# EAGLE board rxsms-2.0 (EAGLE 6.6.0)
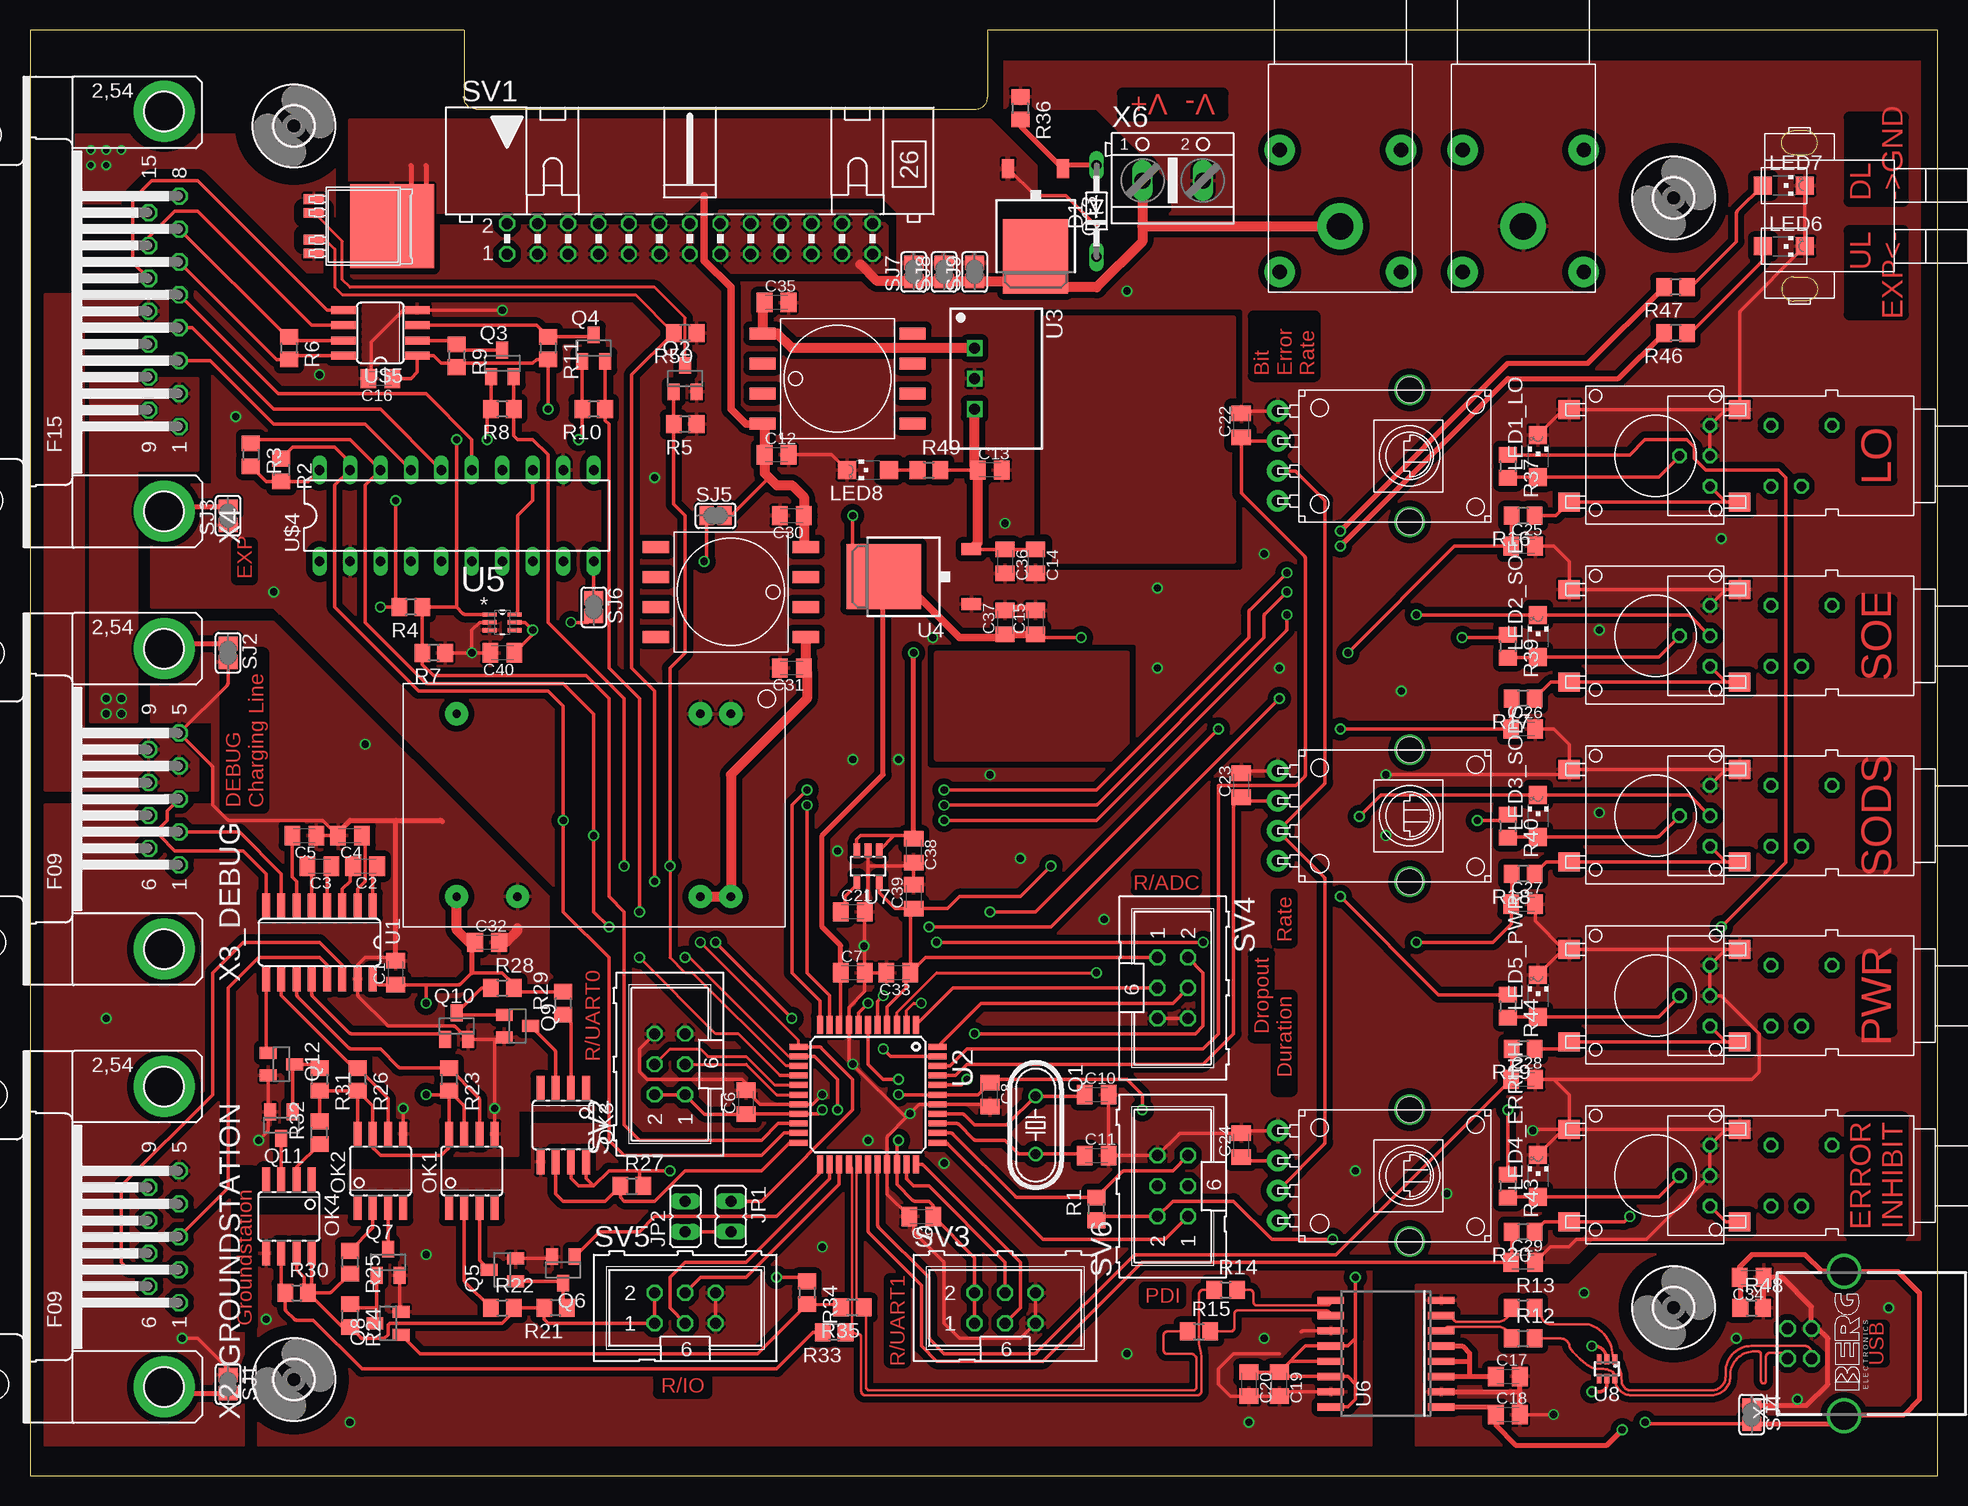
[diagram p8: board, top side]
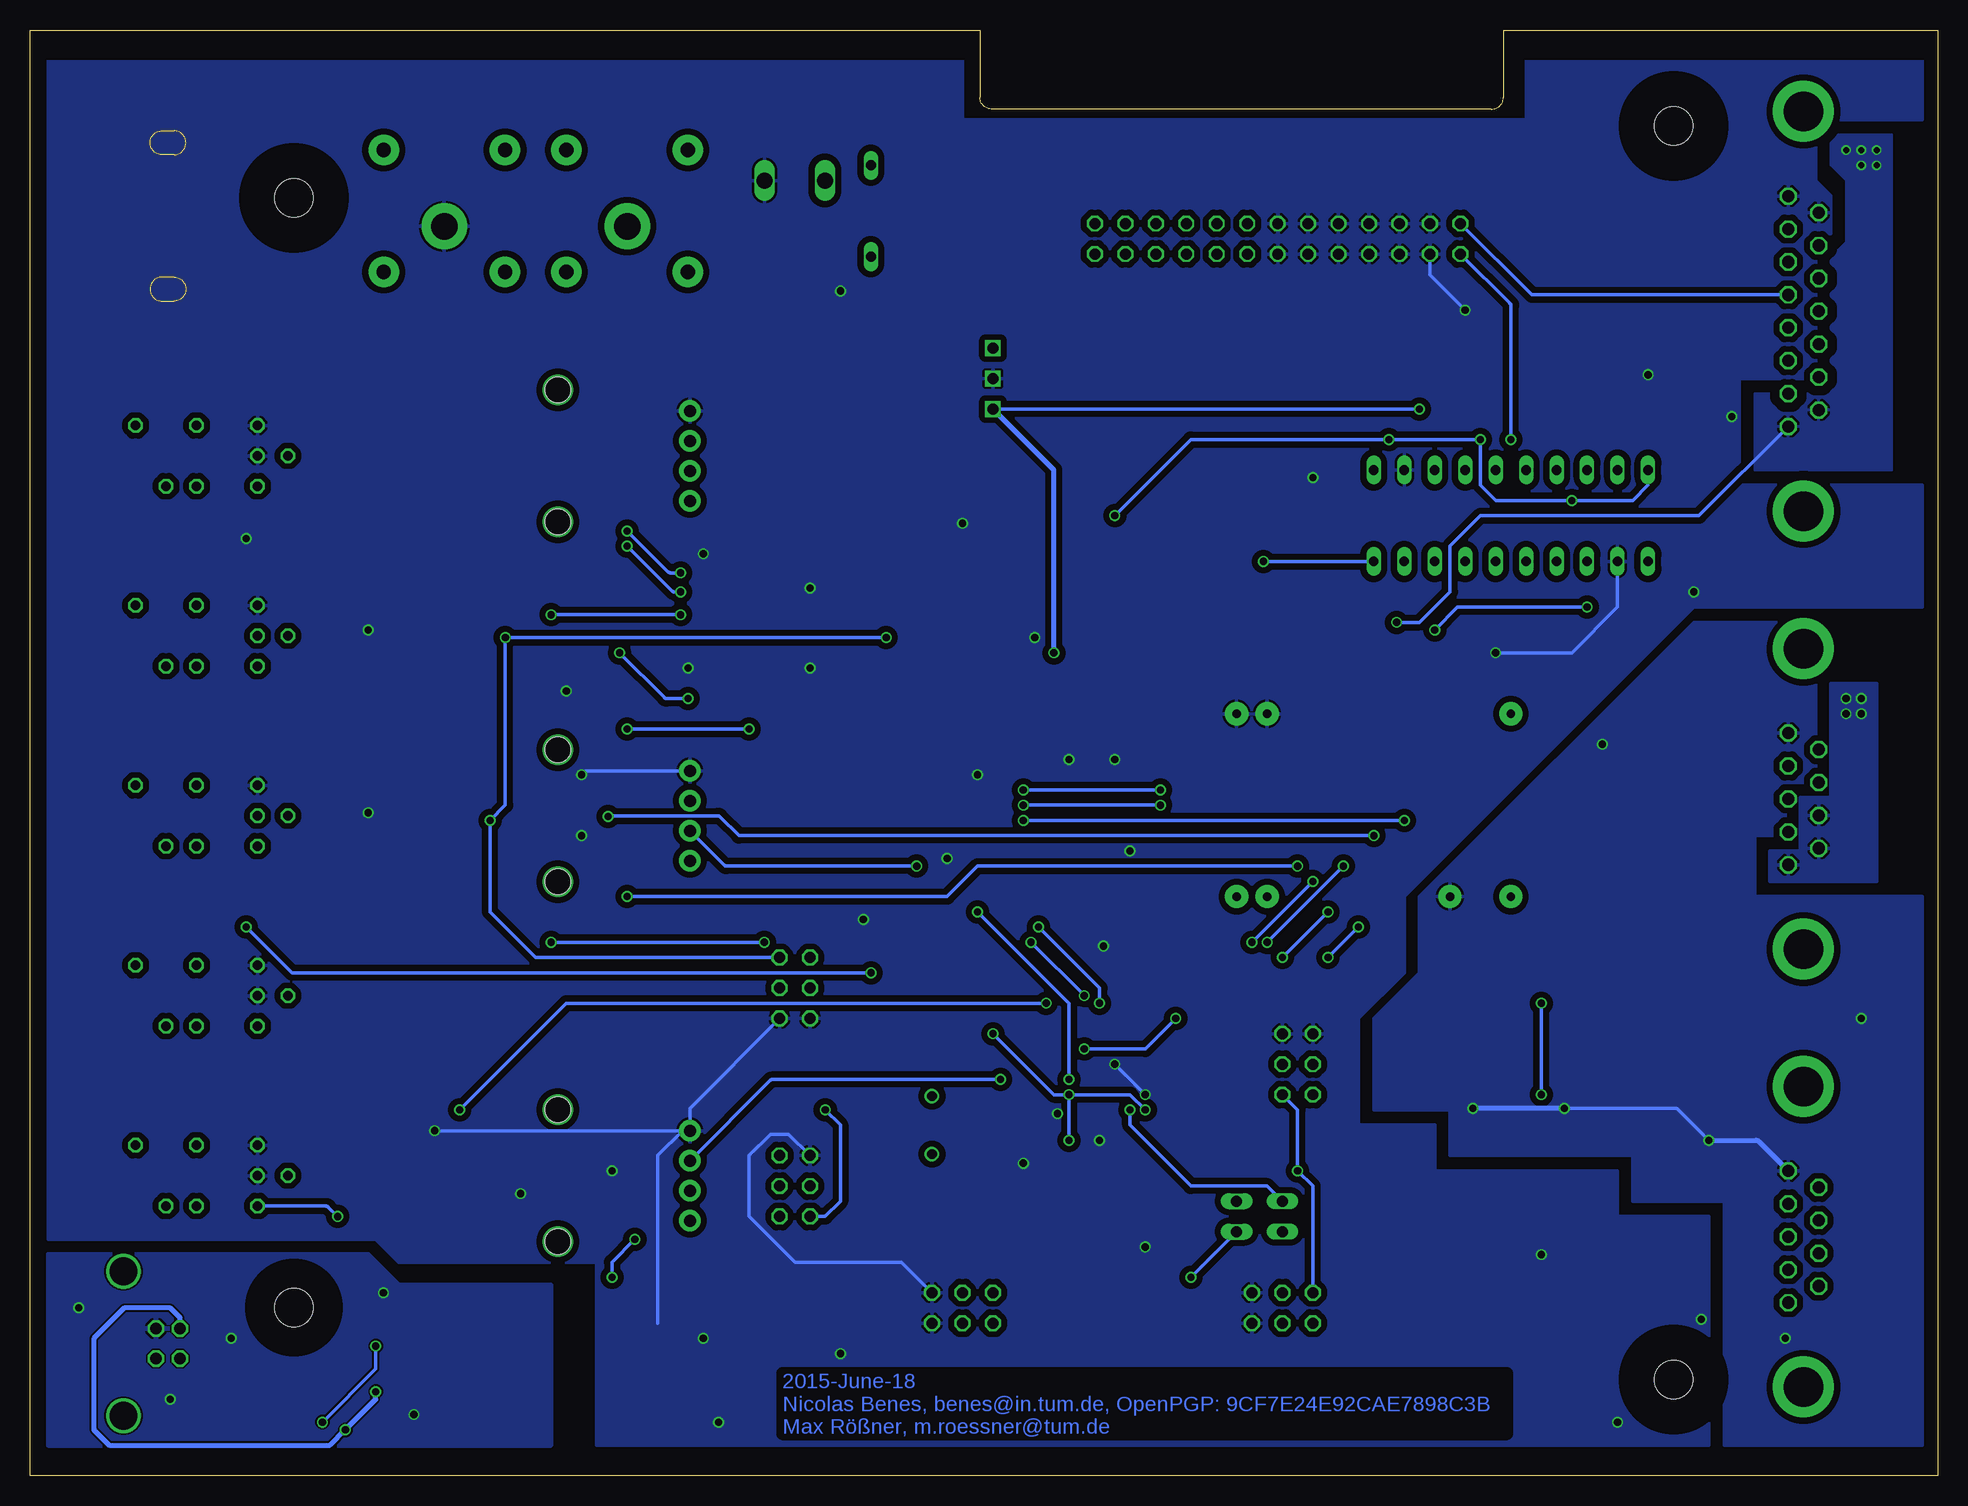
[diagram p9: board, bottom side, seen from below]

Size 159 x 120.5 mm. Coordinates in mm from the lower left corner, seen from the top.
Outline: 0,0 159,0 159,120.5 79.82,120.5 79.82,114.9 arc-90 78.82,113.9 37.18,113.9 arc-90 36.18,114.9 36.18,120.5 0,120.5 0,0
Copper layers (1*16): Top 0.035mm / dielectric 1.5mm / Bottom 0.035mm
Design rules "multi-cb_035um-cu *": minimum track width 6mil, minimum drill 12mil, track to track 6mil, track to pad 6mil, pad to pad 6mil, via to via 6mil, smd to smd 6mil, copper to edge 20mil, drill to drill 8mil, minimum pad ring 8mil, minimum via ring 6mil, stop-mask expansion 3mil, vias tented up to drill 0mil, thermal gap 8mil
tRestrict: area 0,118.5 to 159,120.5; area 0,0 to 159,1.9
bRestrict: area 0,0 to 159,1.9; area 0,118.5 to 159,120.5

## Footprints (pad centres in the part's own frame; a part is rotated, then mirrored left to right if it is on the bottom)
C0805K = smd 1.3 x 1.6: 1 -1,0; 2 1,0
DO34Z7 = drill 0.813 long: A 3.81,0; C -3.81,0
JP1 = drill 0.914 long: 1 0,-1.27; 2 0,1.27
BOURNS-SRR0906 = smd 2.2 x 1: P1 -6.25,3.75; P2 -6.25,1.25; P3 -6.25,-1.25; P4 -6.25,-3.75; P5 6.25,-3.75; P6 6.25,-1.25; P7 6.25,1.25; P8 6.25,3.75
CHIPLED_1206 = smd 1.5 x 1.5: A 0,-1.75; C 0,1.75
SOIC08 = smd 0.66 x 2.032: 1 -1.905,-3.073; 2 -0.635,-3.073; 3 0.635,-3.073; 4 1.905,-3.073; 5 1.905,3.073; 6 0.635,3.073; 7 -0.635,3.073; 8 -1.905,3.073
HC49/S = drill 0.813: 1 -2.413,0; 2 2.413,0
SOT23 = smd 1 x 1.4: 1 -0.95,-1.1; 2 0.95,-1.1; 3 0,1.1
TO252 = smd 1 x 1.6: 1 -2.28,-4.8; 2 2.28,-4.8 | smd 5.4 x 6.2: 3 0,2.5
R0805 = smd 1.3 x 1.5: 1 -0.95,0; 2 0.95,0
SJ = smd 1.168 x 1.6: 1 -0.762,0; 2 0.762,0
ML26L = drill 0.914 octagon: 1 -15.24,-1.27; 2 -15.24,1.27; 3 -12.7,-1.27; 4 -12.7,1.27; 5 -10.16,-1.27; 6 -10.16,1.27; 7 -7.62,-1.27; 8 -7.62,1.27; 9 -5.08,-1.27; 10 -5.08,1.27; 11 -2.54,-1.27; 12 -2.54,1.27; 13 0,-1.27; 14 0,1.27; 15 2.54,-1.27; 16 2.54,1.27; 17 5.08,-1.27; 18 5.08,1.27; 19 7.62,-1.27; 20 7.62,1.27; 21 10.16,-1.27; 22 10.16,1.27; 23 12.7,-1.27; 24 12.7,1.27; 25 15.24,-1.27; 26 15.24,1.27
ML6 = drill 0.914 octagon: 1 -2.54,-1.27; 2 -2.54,1.27; 3 0,-1.27; 4 0,1.27; 5 2.54,-1.27; 6 2.54,1.27
IP67 = smd 1.6 x 1.8: 1 -3.865,7; 2 -3.865,-7.2; 3 3.865,7; 4 3.865,-7.2
SWITCH_LED = drill 0.8 octagon: 1B 5.08,-2.54; 2A 0,-2.54; 2B 2.54,2.54; 3A 10.16,-2.54; 3B 5.08,2.54; A 12.7,0; A1 10.16,2.54; K 10.16,0
SO16 = smd 0.66 x 2.032: 1 -4.445,-3.073; 2 -3.175,-3.073; 3 -1.905,-3.073; 4 -0.635,-3.073; 5 0.635,-3.073; 6 1.905,-3.073; 7 3.175,-3.073; 8 4.445,-3.073; 9 4.445,3.073; 10 3.175,3.073; 11 1.905,3.073; 12 0.635,3.073; 13 -0.635,3.073; 14 -1.905,3.073; 15 -3.175,3.073; 16 -4.445,3.073
TQFP44 = smd 1.5 x 0.5: 1 -5.8,4; 2 -5.8,3.2; 3 -5.8,2.4; 4 -5.8,1.6; 5 -5.8,0.8; 6 -5.8,0; 7 -5.8,-0.8; 8 -5.8,-1.6; 9 -5.8,-2.4; 10 -5.8,-3.2; 11 -5.8,-4; 23 5.8,-4; 24 5.8,-3.2; 25 5.8,-2.4; 26 5.8,-1.6; 27 5.8,-0.8; 28 5.8,0; 29 5.8,0.8; 30 5.8,1.6; 31 5.8,2.4; 32 5.8,3.2; 33 5.8,4 | smd 0.5 x 1.5: 12 -4,-5.8; 13 -3.2,-5.8; 14 -2.4,-5.8; 15 -1.6,-5.8; 16 -0.8,-5.8; 17 0,-5.8; 18 0.8,-5.8; 19 1.6,-5.8; 20 2.4,-5.8; 21 3.2,-5.8; 22 4,-5.8; 34 4,5.8; 35 3.2,5.8; 36 2.4,5.8; 37 1.6,5.8; 38 0.8,5.8; 39 0,5.8; 40 -0.8,5.8; 41 -1.6,5.8; 42 -2.4,5.8; 43 -3.2,5.8; 44 -4,5.8
TSR-1 = drill 0.9 square: 1 -2.54,0; 2 0,0; 3 2.54,0
SOT65P210X110-6N = smd 1.168 x 0.356: 1 -1.041,0.66; 2 -1.041,0; 3 -1.041,-0.66; 4 1.041,-0.66; 5 1.041,0; 6 1.041,0.66
SO-16W = smd 0.6 x 2.2: 1 -4.445,-4.6; 2 -3.175,-4.6; 3 -1.905,-4.6; 4 -0.635,-4.6; 5 0.635,-4.6; 6 1.905,-4.6; 7 3.175,-4.6; 8 4.445,-4.6; 9 4.445,4.6; 10 3.175,4.6; 11 1.905,4.6; 12 0.635,4.6; 13 -0.635,4.6; 14 -1.905,4.6; 15 -3.175,4.6; 16 -4.445,4.6
SOT25 = smd 0.55 x 1.2: 1 -0.95,-1.3; 2 0,-1.3; 3 0.95,-1.3; 4 0.95,1.3; 5 -0.95,1.3
SOT363_PHILIPS = smd 0.4 x 0.8: 1 -0.65,-0.8; 2 0,-0.8; 3 0.65,-0.8; 4 0.65,0.8; 5 0,0.8; 6 -0.65,0.8
3,2 = hole 3.2: 0,0
JACK = drill 1.2 pad 2.54: NC1 -6.36,5.06; NC2 3.8,5.06; NC3 -6.36,-5.06; NC4 3.8,-5.06 | drill 2.2 pad 3.81: P$1 0,0
DIL20 = drill 0.813 long: 1 -3.81,11.43; 2 -3.81,8.89; 3 -3.81,6.35; 4 -3.81,3.81; 5 -3.81,1.27; 6 -3.81,-1.27; 7 -3.81,-3.81; 8 -3.81,-6.35; 9 -3.81,-8.89; 10 -3.81,-11.43; 11 3.81,-11.43; 12 3.81,-8.89; 13 3.81,-6.35; 14 3.81,-3.81; 15 3.81,-1.27; 16 3.81,1.27; 17 3.81,3.81; 18 3.81,6.35; 19 3.81,8.89; 20 3.81,11.43
SO08 = smd 0.66 x 2.032: 1 -1.905,-3.073; 2 -0.635,-3.073; 3 0.635,-3.073; 4 1.905,-3.073; 5 1.905,3.073; 6 0.635,3.073; 7 -0.635,3.073; 8 -1.905,3.073
TO-252-5-1 = smd 0.813 x 1.676: PIN1 -2.255,-3; PIN2 -1.115,-3; PIN4 1.115,-3; PIN5 2.255,-3 | smd 7 x 7: TAB 0,3.51
VERT_POTI = drill 1 pad 1.778: P1 -3.75,-11; P2 -1.25,-11; P3 1.25,-11; P4 3.75,-11 | drill 2.1: P$5 5.5,0; P$6 -5.5,0 | hole 2.1: 5.5,0; -5.5,0
TEN3-2410N = drill 0.7 pad 1.93: P2 0,-15.24; P3 2.54,-15.24; P11 22.86,-15.24; P14 22.86,0; P16 17.78,0; P22 2.54,0; P23 0,0
PN61729-S = drill 0.95 octagon: 1 1.25,4.71; 2 -1.25,4.71; 3 -1.25,2.71; 4 1.25,2.71 | drill 2.3 pad 2.9: S1 -6.02,0; S2 6.02,0
F09HP = drill 1.016 octagon: 1 -5.486,-1.27; 2 -2.743,-1.27; 3 0,-1.27; 4 2.743,-1.27; 5 5.486,-1.27; 6 -4.115,1.27; 7 -1.372,1.27; 8 1.372,1.27; 9 4.115,1.27 | drill 3.302 pad 5.08: G1 -12.522,0; G2 12.522,0
F15HP = drill 1.016 octagon: 1 -9.601,-1.27; 2 -6.858,-1.27; 3 -4.115,-1.27; 4 -1.372,-1.27; 5 1.372,-1.27; 6 4.115,-1.27; 7 6.858,-1.27; 8 9.601,-1.27; 9 -8.23,1.27; 10 -5.486,1.27; 11 -2.743,1.27; 12 0,1.27; 13 2.743,1.27; 14 5.486,1.27; 15 8.23,1.27 | drill 3.302 pad 5.08: G1 -16.662,0; G2 16.662,0
AK500/2 = drill 1.321 long: 1 -2.515,0; 2 2.515,0

## Placement (x,y rotation side)
C1  1u  [C0805K]  30.48,41.91 90 top
C2  1u  [C0805K]  27.94,50.8 180 top
C3  1u  [C0805K]  24.13,50.8 180 top
C4  1u  [C0805K]  26.67,53.34 180 top
C5  1u  [C0805K]  22.86,53.34 180 top
C6  100n  [C0805K]  59.69,31.11 90 top
C7  100n  [C0805K]  68.58,41.91 0 top
C8  100n  [C0805K]  80.01,31.75 270 top
C9  100n  [C0805K]  74.3,21.59 180 top
C10  opt  [C0805K]  88.9,31.75 0 top
C11  opt  [C0805K]  88.9,26.67 0 top
C12  4u7/50V  [C0805K]  62.23,85.09 0 top
C13  4u7/50V  [C0805K]  80.01,83.82 0 top
C14  22u/25V  [C0805K]  83.82,76.2 270 top
C15  22u/25V  [C0805K]  83.82,71.12 90 top
C16  100n  [C0805K]  29.21,91.44 180 top
C17  1u  [C0805K]  123.19,8.26 0 top
C18  1u  [C0805K]  123.19,5.08 0 top
C19  1u  [C0805K]  104.14,7.62 270 top
C20  1u  [C0805K]  101.6,7.62 270 top
C21  100n  [C0805K]  68.58,46.99 0 top
C22  100n  [C0805K]  100.97,87.54 90 top
C23  100n  [C0805K]  100.97,57.54 90 top
C24  100n  [C0805K]  100.97,27.54 90 top
C25  100n  [C0805K]  124.46,77.47 0 top
C26  100n  [C0805K]  124.46,62.23 0 top
C27  100n  [C0805K]  124.46,47.62 0 top
C28  100n  [C0805K]  124.46,33.02 0 top
C29  100n  [C0805K]  124.46,17.78 0 top
C30  4u7/50V  [C0805K]  63.5,80.01 180 top
C31  4u7/50V  [C0805K]  63.5,67.31 180 top
C32  10u/16V  [C0805K]  38.1,44.45 0 top
C33  100n  [C0805K]  72.39,41.91 180 top
C34  4n7  [C0805K]  143.51,16.51 180 top
C35  4u7/50V  [C0805K]  62.23,97.79 0 top
C36  100n  [C0805K]  81.28,76.2 270 top
C37  100n  [C0805K]  81.28,71.12 90 top
C38  100n  [C0805K]  73.66,52.07 270 top
C39  100n  [C0805K]  73.66,48.26 90 top
C40  100n  [C0805K]  39.37,68.58 180 top
D1  12V  [DO34Z7]  88.9,105.41 90 top
JP1  [JP1]  58.42,21.59 180 top
JP2  [JP1]  54.61,21.59 0 top
L1  COIL  [BOURNS-SRR0906]  58.42,73.66 180 top
L2  COIL  [BOURNS-SRR0906]  67.31,91.44 0 top
LED1_LO  YELLOW  [CHIPLED_1206]  125.7,85 0 top
LED2_SOE  YELLOW  [CHIPLED_1206]  125.7,70 0 top
LED3_SODS  YELLOW  [CHIPLED_1206]  125.7,55 0 top
LED4_ERRINH  GREEN  [CHIPLED_1206]  125.7,25 0 top
LED5_PWR  GREEN  [CHIPLED_1206]  125.7,40 0 top
LED6  BERNSTEIN  [CHIPLED_1206]  146.2,102.46 270 top
LED7  BERNSTEIN  [CHIPLED_1206]  146.2,107.54 270 top
LED8  GREEN  [CHIPLED_1206]  69.85,83.82 90 top
OK1  HCPL0600  [SOIC08]  36.83,25.4 0 top
OK2  HCPL0600  [SOIC08]  29.21,25.4 0 top
OK3  HCPL0600  [SOIC08]  44.45,29.21 180 top
OK4  HCPL0600  [SOIC08]  21.59,21.59 180 top
Q1  opt  [HC49/S]  83.82,29.21 270 top
Q2  BSS123  [SOT23]  54.61,91.44 0 top
Q3  BSS123  [SOT23]  39.37,92.71 0 top
Q4  BSS123  [SOT23]  46.99,93.98 0 top
Q5  BSS123  [SOT23]  39.37,17.14 90 top
Q6  BSS123  [SOT23]  44.45,17.14 180 top
Q7  BSS123  [SOT23]  29.84,17.78 0 top
Q8  BSS123  [SOT23]  29.84,12.7 90 top
Q9  BSS123  [SOT23]  40.64,37.47 270 top
Q10  BSS123  [SOT23]  35.56,37.47 0 top
Q11  BSS123  [SOT23]  20.95,29.21 180 top
Q12  BSS123  [SOT23]  20.95,34.29 270 top
Q13  FDD4141TO252  [TO252]  83.82,104.14 180 top
R1  10k  [R0805]  88.9,22.23 90 top
R2  10k  [R0805]  20.95,83.82 270 top
R3  10k  [R0805]  18.41,85.09 270 top
R4  2k2  [R0805]  31.75,72.39 180 top
R5  10k  [R0805]  54.61,87.63 180 top
R6  10k  [R0805]  21.59,93.98 270 top
R7  10k  [R0805]  33.66,68.58 180 top
R8  10k  [R0805]  39.37,88.9 180 top
R9  10k  [R0805]  35.56,93.34 270 top
R10  10k  [R0805]  46.99,88.9 180 top
R11  10k  [R0805]  43.18,93.98 270 top
R12  24/1%  [R0805]  124.46,11.43 0 top
R13  24/1%  [R0805]  124.46,13.97 0 top
R14  24/1%  [R0805]  99.67,15.48 0 top
R15  24/1%  [R0805]  97.43,12 0 top
R16  1k  [R0805]  124.46,80.01 180 top
R17  1k  [R0805]  124.46,64.77 180 top
R18  1k  [R0805]  124.46,50.16 180 top
R19  1k  [R0805]  124.46,35.56 180 top
R20  1k  [R0805]  124.46,20.32 180 top
R21  10k  [R0805]  43.81,13.97 180 top
R22  127  [R0805]  39.37,13.97 0 top
R23  10k  [R0805]  34.93,33.02 270 top
R24  10k  [R0805]  26.67,13.34 270 top
R25  127  [R0805]  26.67,17.78 270 top
R26  10k  [R0805]  27.3,33.02 270 top
R27  10k  [R0805]  50.16,24.13 0 top
R28  10k  [R0805]  39.37,40.64 0 top
R29  270  [R0805]  44.45,39.37 90 top
R30  10k  [R0805]  22.23,15.24 0 top
R31  10k  [R0805]  24.13,33.02 270 top
R32  270  [R0805]  24.13,28.57 90 top
R33  0  [R0805]  67.03,11.95 180 top
R34  0  [R0805]  64.77,15.24 270 top
R35  0  [R0805]  68.55,14.01 180 top
R36  1k  [R0805]  82.55,113.98 270 top
R37  2k2  [R0805]  123.19,84.13 270 top
R39  2k2  [R0805]  123.19,69.13 270 top
R40  2k2  [R0805]  123.19,54.13 270 top
R43  1k  [R0805]  123.19,24.13 270 top
R44  1k  [R0805]  123.19,39.13 270 top
R46  1k/100  [R0805]  137.16,95.25 180 top
R47  1k/100  [R0805]  137.16,99.06 180 top
R48  1M  [R0805]  143.51,13.97 0 top
R49  2k7  [R0805]  74.93,83.82 0 top
R50  330  [R0805]  54.61,95.25 180 top
SCREW1  4-40/M3  [SCREW_DUMMY]  -3.07,7.62 0 top  (outside the outline)
SCREW2  4-40/M3  [SCREW_DUMMY]  -3.19,31.75 0 top  (outside the outline)
SCREW3  4-40/M3  [SCREW_DUMMY]  -3.32,44.45 0 top  (outside the outline)
SCREW4  4-40/M3  [SCREW_DUMMY]  -3.45,68.58 0 top  (outside the outline)
SCREW5  4-40/M3  [SCREW_DUMMY]  -3.57,81.28 0 top  (outside the outline)
SCREW6  4-40/M3  [SCREW_DUMMY]  -3.7,111.76 0 top  (outside the outline)
SJ1  [SJ]  16.51,7.62 270 top
SJ2  [SJ]  16.51,68.58 270 top
SJ3  [SJ]  16.51,80.01 90 top
SJ4  [SJ]  143.51,5.08 270 top
SJ5  [SJ]  57.15,80.01 0 top
SJ6  [SJ]  46.99,72.39 270 top
SJ7  [SJ]  73.66,100.33 90 top
SJ8  [SJ]  76.2,100.33 90 top
SJ9  [SJ]  78.74,100.33 90 top
SV1  [ML26L]  55,103.1 0 top
SV2  [ML6]  53.34,34.29 90 top
SV3  [ML6]  81.28,13.97 0 top
SV4  [ML6]  95.25,40.64 270 top
SV5  [ML6]  54.61,13.97 0 top
SV6  [ML6]  95.25,24.13 90 top
T1_LO  SMS_IP67  [IP67]  135.5,85 270 top
T2_SOE  SMS_IP67  [IP67]  135.5,70 270 top
T3_SOE  SWITCH_LED  [SWITCH_LED]  150.2,70 180 top
T4_PWR  SMS_IP67  [IP67]  135.5,40 270 top
T5_ERRINH  SMS_IP67  [IP67]  135.5,25 270 top
T6_PWR  SWITCH_LED  [SWITCH_LED]  150.2,40 180 top
T7_ERRINH  SWITCH_LED  [SWITCH_LED]  150.2,25 180 top
T8_LO  SWITCH_LED  [SWITCH_LED]  150.2,85 180 top
T9_SODS  SMS_IP67  [IP67]  135.5,55 270 top
T10_SODS  SWITCH_LED  [SWITCH_LED]  150.2,55 180 top
U1  MAX3232ESE  [SO16]  24.13,44.45 180 top
U2  XMEGA-A4UTQFP  [TQFP44]  69.85,31.75 270 top
U3  TSR_1-2450  [TSR-1]  78.74,91.44 270 top
U4  LM1117  [TO252]  73.66,74.93 90 top
U5  NC7WZ17P6X  [SOT65P210X110-6N]  39.37,71.12 0 top
U6  ADUM3160  [SO-16W]  113.03,10.16 90 top
U7  TPS73125  [SOT25]  69.85,50.8 180 top
U8  NUP2202W1  [SOT363_PHILIPS]  131.44,8.89 180 top
U$1  [3,2]  22,8 0 top
U$2  [3,2]  22,112.5 0 top
U$3  black  [JACK]  124.46,104.14 270 top
U$4  UDN2596  [DIL20]  35.56,80.01 90 top
U$5  SP490  [SO08]  29.21,95.25 90 top
U$6  BTS6143  [TO-252-5-1]  26.67,104.14 270 top
U$7  [3,2]  137,14 0 top
U$7_BER  50k  [VERT_POTI]  115,85 270 top
U$8  [3,2]  137,106.5 0 top
U$8_DROPR  50k  [VERT_POTI]  115,55 270 top
U$9  red  [JACK]  109.22,104.14 270 top
U$9_DROPDUR  50k  [VERT_POTI]  115,25 270 top
U$10  TEN3-2410N  [TEN3-2410N]  58.42,48.26 180 top
X1  PN61729-S  [PN61729-S]  151.21,11 90 top
X2_GROUNDSTATION  [F09HP]  11.17,19.9 90 top
X3_DEBUG  [F09HP]  11.17,56.4 90 top
X4  [F15HP]  11.17,97.05 90 top
X5  RLP2-200-500  [RLP2-200-500]  146.2,105 90 top
X6  [AK500/2]  95.25,107.95 0 top

## Tracks (layer width: path | path; a pad name or v marks a point on that pad's centre or on a via)
!EXP_LO
  Top 0.305: X4.5 20.69,90.17 33.02,90.17 36.83,86.36 U$4.15
  Bottom 0.305: SV1.2 33.81,98.42 X4.5
!EXP_SODS
  Top 0.305: X4.3 15.02,92.94 20.32,87.63 27.94,87.63 U$4.17
!EXP_SOE
  Top 0.305: U$4.16 29.21,88.9 20.32,88.9 13.54,95.68 X4.4
!SIM_LO  (via drill 0.6)
  Top 0.305: 35.56,72.39 36.08,71.87 arc45 36.3,71.78 U5.1 | R4.1 35.56,72.39 | R4.1 32.65,72.34 arc45 32.55,72.11 | U2.20 62.37,29.35 60.96,27.94 50.8,27.94 49.53,29.21 49.53,46.99 48.26,48.26 48.26,64.77 46.35,66.67 33.66,66.67 32.7,67.62 R7.2 R4.1 | 35.56,72.39 v35.56,86.36
  Bottom 0.305: SV1.1 35.65,97.72 | 35.65,97.72 arc45 35.56,97.5 | v35.56,86.36 35.56,97.63 35.65,97.72
!SIM_SODS  (via drill 0.6)
  Top 0.254: v50.8,43.18 57.15,36.83 59.05,36.83 62.53,33.35
  Top 0.305: R3.1 18.73,86.36 26.67,86.36 U$4.18 27.94,82.55 27.94,71.12 33.02,66.04 44.45,66.04 46.99,63.5 v46.99,53.34 46.99,46.99 v48.26,45.72 | T10_SODS.K 138.38,56.66 arc45 138.16,56.75 LED3_SODS.C 112.73,56.75 arc45 112.56,56.68 v110.81,54.93 | U2.15 62.53,33.35
  Bottom 0.305: v50.8,43.18 v48.26,45.72 | v46.99,53.34 99.91,53.34 101.48,54.92 arc-45 101.66,54.99 110.65,54.99 arc-45 v110.81,54.93
!SIM_SOE  (via drill 0.6)
  Top 0.305: R2.1 21.91,85.72 25.4,85.72 26.67,84.45 U$4.19 25.4,82.55 25.4,72.39 32.38,65.41 43.18,65.41 44.45,64.14 v44.45,54.61 44.45,46.99 48.26,43.18 48.26,27.94 49.53,26.67 60.96,26.67 62.84,28.55 U2.21 | T3_SOE.K 138.38,71.66 arc45 138.16,71.75 LED2_SOE.C v115.58,71.75 v115.57,71.75 | v76.2,54.61 88.9,54.61 104.7,70.41 arc45 104.78,70.59 v104.78,71.75
  Bottom 0.305: v115.57,71.75 v104.78,71.75 | v76.2,54.61 v44.45,54.61
+3V3  (via drill 0.6)
  Top 0.305: R30.2 23.5,15.56 OK4.8 | OK4.7 22.23,17.14 22.86,16.51 22.86,15.55 R30.2 | U2.9 67.58,37.68 C7.1 | Q3.1 R8.2 38.19,88.67 arc45 38.1,88.45 v38.1,86.36 | Q4.1 R10.2 46.04,86.81 arc-45 45.95,86.59 v45.72,86.36 | C19.1 106.31,10.79 U6.12 109.86,10.79 110.49,11.43 | U6.13 105.05,9.53 C19.1 | C19.1 104.5,8.26 U6.14 109.86,8.26 110.49,7.62 | 110.49,7.62 110.49,6.35 109.86,5.71 U6.16 | C20.1 C19.1 | 123.27,55 R40.1 122.72,54.61 v120.65,54.61 | R39.1 123.27,70 123.12,69.85 v119.38,69.85 | R3.2 19.68,82.87 R2.2 23.18,82.87 U$4.20 | R1.1 89.12,21.5 arc-45 89.35,21.59 SV6.2 95.25,22.86 100.33,22.86 103.5,19.68 v108.58,19.68 | SV3.1 SV3.2 78.74,18.01 arc45 78.65,18.24 C9.1 75.3,22.36 arc45 75.2,22.59 74.93,22.86 73.79,22.86 arc-45 73.57,22.95 72.25,24.27 U2.31 72.25,27.8 v72.39,27.94 | SV2.2 SV2.1 56.24,30.11 C6.1 59.73,30.15 U2.19 65.71,30.15 v66.04,30.48 | U4.3 68.58,77.51 v68.58,80.01 | v30.48,81.28 30.48,72.84 arc45 30.57,72.62 R4.2 v29.21,72.39 | SV5.2 SV5.1 43.18,12.7 42.87,13.02 R21.2 R22.2 40.32,13.65 39.37,12.7 30.1,12.7 arc90 29.84,12.45 29.84,11.75 29.53,11.43 27.73,11.43 arc-45 27.55,11.5 R24.2 26.14,12.38 arc-45 25.96,12.46 R30.2 | v110.49,16.51 110.49,11.43 | 110.49,7.62 110.49,11.43 | v92.71,30.48 92.71,31.75 91.44,33.02 80.28,33.02 C8.1 79.01,31.75 U2.39 v72.39,31.75 | OK3.7 45.09,24.77 45.72,24.13 46.99,24.13 | 46.99,24.13 48.26,25.4 50.8,25.4 | 50.8,25.4 50.8,24.45 R27.2 | 50.8,25.4 v53.34,25.4 | OK3.8 46.35,24.77 46.99,24.13 | v87.63,69.85 84.09,69.85 C15.1 | SV4.2 97.79,41.91 97.79,37.47 97.16,36.83 v78.74,36.83 | C40.1 41.91,70.12 v41.91,70.48 41.27,71.12 U5.5
  Top 0.305: R25.2 25.15,15.31 arc-45 24.98,15.24 R30.2
  Top 0.406: C7.1 67.58,44.18 66.04,45.72 66.04,53.34 71.12,58.42 71.12,74.93 72.39,74.93
  Top 0.61: C15.1 C37.1 81.01,69.85 77.47,69.85 72.39,74.93 U4.3
  Bottom 0.305: v68.58,80.01 62.23,86.36 v45.72,86.36 v38.1,86.36 38.1,82.55 36.83,81.28 v30.48,81.28 25.4,81.28 24.13,82.55 U$4.20 | v108.58,19.68 110.49,17.78 v110.49,16.51 | v92.71,30.48 91.44,29.21 91.44,22.86 92.71,21.59 SV6.2 | v72.39,31.75 v72.39,27.94 | SV2.1 53.34,30.48 v53.34,25.4 52.07,24.13 SV5.2 | v87.63,69.85 v119.38,69.85 119.38,55.88 v120.65,54.61 120.65,46.99 116.84,43.18 SV4.2 | v78.74,36.83 73.66,31.75 v72.39,31.75 | v66.04,30.48 67.31,31.75 v72.39,31.75 | v29.21,72.39 40.01,72.39 v41.91,70.48
+5V  (via drill 0.6)
  Top 0.305: C16.1 31.75,91.44 32.28,91.97 U$5.1 33.66,93.34 34.29,92.71 35.24,92.71 R9.2 35.88,92.71 41.91,92.71 42.23,93.03 R11.2 v43.18,88.9 | C38.1 73.39,53.34 72.04,53.34 | 72.04,53.34 U7.1 | U7.3 68.9,53.02 69.22,53.34 72.04,53.34 | R49.2 C13.1 | C14.1 C36.1 U4.2
  Top 0.406: 73.39,53.34 73.66,53.61 v73.66,68.58
  Top 0.813: U3.3 78.74,84.09 C13.1 79.01,77.76 U4.2
  Bottom 0.305: v43.18,88.9 U3.3
  Bottom 0.406: v73.66,68.58 73.66,83.82 U3.3
+28V_EXP  (via drill 0.5, 0.6)
  Top 0.305: SJ6.2 46.48,71.12 v45.09,71.12
  Bottom 0.305: X4.1 19.88,80.01 38.1,80.01 40.64,77.47 40.64,73.66 43.18,71.12 v45.09,71.12
  other vias: 5.08,110.49 6.35,110.49 6.35,109.22 5.08,109.22 7.62,110.49
  pour Top (isolate 0.813): 22.86,111.76 3.81,111.76 3.81,106.05 15.24,106.05 15.24,104.14 19.05,100.33 25.4,100.33 25.4,109.22
  pour Bottom (isolate 0.813): 8.89,111.76 8.89,109.22 7.62,107.95 7.62,102.87 8.89,101.6 8.89,90.17 15.24,90.17 15.24,83.82 3.81,83.82 3.81,111.76
+28V_SUPPLY
  Top 0.305: SJ5.2 58.42,80.01 61.59,83.19 | Q13.2 83.8,106.68 86.36,106.68 88.9,104.14 D1.C
  Top 0.406: 31.75,109.22 31.75,106.68 | 33.02,109.22 33.02,106.68
  Top 0.61: Q13.2 81.26,109.22 | 56.2,106.68 56.2,101.28 58.42,99.06 58.42,88.9 59.69,87.63 61,87.63 L2.P4 61.23,87.52
  Top 0.813: C30.1 64.5,77.71 arc45 64.59,77.49 L1.P4 | C30.1 64.77,80.01 | 61.23,87.52 C12.1 61.23,83.55 61.59,83.19 62.23,82.55 63.5,82.55 64.5,81.55 C30.1
  pour Top (isolate 0.305): 83.82,106.68 83.82,109.09 80.01,112.9 26.67,112.9 26.67,105.41 54.61,105.41 55.88,106.68 71.12,106.68 72.39,105.41 72.39,100.33 80.33,100.33 80.33,106.68
ADC_CURRENT_SENSE  (via drill 0.6)
  Top 0.254: 24.61,103.03 25.4,102.23 25.4,99.06 26.04,98.42 50.48,98.42 R50.2
  Top 0.305: U$6.PIN4 24.61,103.03 | R50.2 50.16,91.75 50.16,67.31 52.07,65.41 v52.07,49.53 | v57.15,44.45 v63.5,38.1 | v71.12,35.56 71.73,34.95 U2.43
  Bottom 0.305: v52.07,49.53 v57.15,44.45 | v63.5,38.1 66.04,35.56 v71.12,35.56
ADC_POTI_BIT_ERROR_RATE
  Top 0.305: U$7_BER.P2 101.39,86.25 arc-45 101.16,86.34 C22.1 100.97,82.05 arc45 101.06,81.82 106.21,76.67 arc-45 106.3,76.45 106.3,58.42 arc-45 106.21,58.2 105.54,57.53 99.06,57.53 99.06,36.83 97.79,35.56 78.11,35.56 76.69,34.15 U2.42
ADC_POTI_DROP_DURATION  (via drill 0.6)
  Top 0.305: U$9_DROPDUR.P2 101.39,26.25 arc-45 101.16,26.34 C24.1 | U2.40 77.5,32.55 arc45 77.73,32.64 v78.11,33.02
  Bottom 0.305: v78.11,33.02 97.1,33.02 arc-45 97.32,32.93 U$9_DROPDUR.P2
ADC_POTI_DROP_RATE
  Top 0.305: U$8_DROPR.P2 101.39,56.25 arc-45 101.16,56.34 C23.1 100.42,56 arc45 100.33,55.77 100.33,36.83 97.79,34.29 78.11,34.29 77.17,33.35 U2.41
ADC_REF  (via drill 0.6)
  Top 0.305: C39.1 72.12,47.26 70.8,48.58 U7.5 | C33.1 73.03,41.55 73.03,40.64 71.45,39.06 U2.4 | U$7_BER.P3 105.35,83.75 arc-45 105.57,83.66 107.95,81.28 107.95,57.83 arc-45 107.86,57.61 U$8_DROPR.P3 107.86,49.89 arc-45 107.95,49.67 107.95,27.83 arc-45 107.86,27.61 U$9_DROPDUR.P3 | C33.1 73.39,46.99 C39.1 | SV4.1 74.66,43.18 C33.1 | v85.09,50.8 82.55,48.26 77.47,48.26 76.47,47.26 C39.1
  Bottom 0.305: 103.59,53.34 U$8_DROPR.P3 101.12,50.87 arc-45 100.94,50.8 v85.09,50.8
DEBUG_RX_D-
  Top 0.191: U2.26 68.41,25.79 arc-45 68.5,25.57 68.5,12.61 arc-45 68.41,12.38 | 68.41,12.38 R33.1 | 68.41,12.38 arc90 68.98,11.81 arc-90 69.29,11.5 69.29,7.01 arc90 69.61,6.69 97.32,6.69 arc90 97.64,7.01 97.64,9.55 arc16 97.45,10.92 97.45,15.16 arc-90 97.85,15.48 R14.1
DEBUG_TX_D+
  Top 0.191: U2.27 68.99,25.89 arc45 68.9,25.67 68.9,14.75 arc45 68.99,14.52 R35.1 69.5,13.57 arc90 69.69,13.39 69.69,7.4 arc90 70,7.09 96.93,7.09 arc90 97.24,7.4 97.24,9.71 arc45 97.15,9.94 97.04,10.05 arc45 96.81,10.14 94.81,10.14 arc-90 94.49,10.46 94.49,11.68 arc-90 94.81,12 R15.1
EXP_CHG_IN  (via drill 0.6)
  other vias: 6.35,64.77 7.62,64.77 6.35,63.5 7.62,63.5
  pour Bottom: 5.08,66.04 8.89,66.04 8.89,56.52 11.43,56.52 11.43,52.07 13.97,52.07 13.97,49.53 5.08,49.53
  pour Top: 5.08,62.87 8.89,62.87 8.89,83.82 13.97,83.82 13.97,91.44 5.08,91.44
EXP_CHG_RET
  pour Top: 13.97,57.15 1.27,57.15 1.27,98.42 11.43,98.42 11.43,95.89 4.45,95.89 4.45,61.59 13.97,61.59
EXP_SERIAL_FROM_EXP+
  Top 0.305: U$5.8 21.91,93.34 R6.2 20.57,93.03 X4.6
EXP_SERIAL_FROM_EXP-
  Top 0.305: U$5.7 21.91,94.61 R6.1 21.42,94.93 X4.7
EXP_SERIAL_TO_EXP+
  Top 0.305: U$5.5 24.77,97.16 13.97,107.95 10.16,107.95 8.57,106.36 8.57,101.12 X4.13
EXP_SERIAL_TO_EXP-
  Top 0.305: U$5.6 23.5,95.89 13.97,105.41 12.06,105.41 9.9,103.25 X4.14
EXPPWR_EN  (via drill 0.6)
  Top 0.254: v53.34,50.8 53.34,43.18 54.61,41.91 55.24,41.91 63.01,34.15 U2.14
  Top 0.305: 123.27,40 R44.1 117.4,40.08 v109.22,48.26 | Q2.1 R5.2 53.66,80.96 54.61,80.01 54.61,68.58 53.34,67.31 v53.34,50.8
  Bottom 0.305: v109.22,48.26 82.55,48.26 80.01,50.8 v53.34,50.8
GND  (via drill 0.6)
  Top 0.305: Q6.2 43.35,18.09 Q5.2 | Q7.2 30.8,13.8 Q8.2 | C8.2 79.81,30.95 U2.38 74.26,30.95 arc45 74.04,30.86 73.03,29.84 | C7.2 69.58,40.37 68.25,39.04 U2.8 68.25,34.75 arc45 68.34,34.53 v68.58,34.29 73.03,29.84 | C16.2 28.45,91.68 28.45,94.49 31.11,97.16 U$5.4 v39.37,97.16 | C9.2 71.45,23.43 U2.30 71.45,28.14 arc-45 71.54,28.36 73.03,29.84 | U6.15 104.5,6.99 C19.2 C20.2 100.06,6.62 99.06,7.62 99.06,8.89 100.33,10.16 104.14,10.16 | T5_ERRINH.2 127.81,28.86 LED4_ERRINH.C | T5_ERRINH.2 T5_ERRINH.1 141.37,28.86 T7_ERRINH.3A T7_ERRINH.K 134.72,19.68 128.91,19.68 128.27,19.05 126.73,19.05 C29.2 | 127.7,43.75 127.81,43.87 125.46,46.22 C27.2 | 127.7,43.75 LED5_PWR.C | T10_SODS.3A 141.37,58.87 T9_SODS.1 T9_SODS.2 | T3_SOE.3A 141.37,73.86 T2_SOE.1 T2_SOE.2 128.3,76.17 127,77.47 C25.2 | T1_LO.1 141.37,88.86 T8_LO.3A T8_LO.K | T1_LO.1 T1_LO.2 127.81,88.86 LED1_LO.C | LED7.C LED6.C 142.59,97.1 arc45 142.5,96.88 T1_LO.1 | 69.85,50.8 69.85,47.26 C21.2 C7.2 | 69.85,50.8 U7.2 | 69.85,50.8 73.03,50.8 73.3,51.07 C38.2 C39.2 | C7.2 C33.2 | C26.2 127,62.23 128.3,60.93 T9_SODS.2 | T5_ERRINH.2 128.3,31.72 127,33.02 C28.2 143.51,33.02 144.05,33.56 arc45 144.15,33.79 144.15,36.83 141.07,39.91 arc45 140.84,40 T6_PWR.K T6_PWR.3A 141.37,43.87 T4_PWR.1 T4_PWR.2 128.19,43.75 127.7,43.75 | U5.2 37.47,71.12 36.83,70.48 v36.83,68.58 | 35.07,68.58 v36.83,68.58 | v36.83,68.58 C40.2 | U$7_BER.P1 101.31,88.75 arc45 101.08,88.66 C22.2 | U$8_DROPR.P1 101.31,58.75 arc45 101.08,58.66 C23.2 | U$9_DROPDUR.P1 101.31,28.75 arc45 101.08,28.66 C24.2 95.98,28.54 arc45 95.76,28.45 SV6.6 C11.2 C10.2 | U6.11 106.18,12.06 arc45 105.95,11.97
  Top 0.305: SV4.6 SV4.5 | SV2.6 50.8,35.56 50.8,33.66 51.44,33.02 59.37,33.02 59.69,32.7 C6.2 60.85,30.95 U2.18 65.24,30.95 v66.04,31.75 | LED8.C 66.83,85.09 C12.2 | SV5.6 SV5.5 | T1_LO.1 142.53,88.9 | v113.03,58.42 127.86,58.42 T9_SODS.2 | v125.27,28.75 125.39,28.86 T5_ERRINH.2 | 73.66,21.59 73.66,20.32 76.11,17.87 arc-45 76.2,17.65 76.2,12.7 77.38,11.52 arc45 77.6,11.43 82.55,11.43 SV3.5 SV3.6
  Top 0.406: C37.2 81.28,72.39 83.82,72.39
  Top 0.813: 55.56,94.94 R50.1
  Bottom 0.305: v36.83,68.58 30.48,68.58 26.67,72.39 U$4.2 | 106.68,12.7 106.68,26.67 104.6,28.75 U$9_DROPDUR.P1 | SV4.6 104,30.62 U$9_DROPDUR.P1 | U$8_DROPR.P1 112.7,58.75 v113.03,58.42 | v66.04,31.75 v68.58,34.29 | v125.27,28.75 U$9_DROPDUR.P1 | SV6.6 95.76,28.45 97.28,28.45 99.06,26.67 99.06,21.59 95.25,17.78 86.36,17.78 SV3.6 | SV1.3 42.3,100.08 v39.37,97.16
  other vias: 102.87,11.43 110.49,25.4 91.44,10.16 113.03,53.34 17.14,88.27 66.04,19.05 69.85,27.94 89.53,46.35 52.07,83.19 118.11,23.5 114.3,65.41 81.28,79.38 102.87,76.83 80.01,58.42 93.98,67.31 93.98,73.98 75.25,69.85 68.58,59.69 72.39,59.69 104.14,67.31 82.55,51.44 140.97,78.11 130.81,70.48 130.81,55.24 26.67,4.45 101.6,4.45 19.68,13.02 33.02,18.41 73.34,30.16 76.2,26.04 69.53,44.13 67.31,52.07 20.32,73.66 91.44,98.74 24.13,91.76
  pour Bottom (isolate 0.508): 19.05,2.54 19.05,21.59 26.67,21.59 26.67,25.4 41.91,25.4 41.91,29.21 48.26,29.21 48.26,38.1 44.45,41.91 44.45,48.26 20.32,72.39 1.27,72.39 1.27,82.55 16.51,82.55 16.51,91.44 10.16,91.44 10.16,102.23 8.89,103.5 8.89,106.68 10.16,107.95 10.16,113.03 1.27,113.03 1.27,118.11 34.29,118.11 34.29,113.03 81.28,113.03 81.28,118.11 157.48,118.11 157.48,19.68 130.18,19.68 128.27,17.78 111.76,17.78 111.76,2.54
  pour Top (isolate 0.508, rank 3): 19.05,2.54 19.05,21.59 26.67,21.59 26.67,25.4 41.91,25.4 41.91,29.21 48.26,29.21 48.26,38.1 44.45,41.91 44.45,48.26 20.32,72.39 10.16,72.39 10.16,82.55 15.24,82.55 15.24,92.71 6.35,92.71 6.35,94.61 12.7,94.61 12.7,103.5 13.97,103.5 18.73,99.06 26.67,99.06 26.67,104.14 55.24,104.14 55.24,100.97 56.83,99.38 76.52,99.38 77.4,100.26 arc-45 77.58,100.33 90.17,100.33 95.25,105.41 95.25,107.63 88.9,113.98 81.28,113.98 81.28,118.11 157.48,118.11 157.48,19.68 130.18,19.68 128.27,17.78 111.76,17.78 111.76,2.54
LED_ERRINH  (via drill 0.6)
  Top 0.254: U2.2 73.05,38.76 73.66,39.37 v74.3,39.37
  Top 0.305: 123.27,25 R43.1 v123.19,30.48
  Bottom 0.305: v74.3,39.37 114.3,39.37 v123.19,30.48
LED_LO  (via drill 0.6)
  Top 0.254: U2.3 72.25,38.59 75.56,41.91 v88.9,41.91
  Top 0.305: 123.27,85 R37.1 133.34,85.08 134.62,86.36 138.11,86.36 138.75,85.72 138.75,84.77 139.7,83.82 145.73,83.82 146.37,83.19 146.37,51.12 v140.97,45.72
  Bottom 0.305: v88.9,41.91 137.16,41.91 v140.97,45.72
LED_TO_EXP_ACTIVE  (via drill 0.6)
  Top 0.305: U2.10 66.65,40.03 64.77,41.91 v64.77,55.88 | v76.2,55.88 88.8,55.88 arc45 88.97,55.95 102.87,69.85 102.87,71.65 arc-45 102.94,71.83 v104.78,73.66
  Top 0.406: v109.22,77.47 123.19,91.44 132.4,91.44 R46.2
  Bottom 0.305: v64.77,55.88 v76.2,55.88 | v109.22,77.47 105.48,73.73 arc-45 105.31,73.66 v104.78,73.66
LED_TO_GND_ACTIVE  (via drill 0.6)
  Top 0.305: U2.11 65.85,39.56 63.5,41.91 63.5,55.88 v64.77,57.15 | v76.2,57.15 88.9,57.15 101.6,69.85 101.6,71.97 arc-45 101.67,72.15 v104.78,75.25
  Top 0.406: v109.22,78.74 123.19,92.71 129.86,92.71 R47.2
  Bottom 0.305: v64.77,57.15 v76.2,57.15 | v109.22,78.74 105.8,75.32 arc-45 105.62,75.25 v104.78,75.25
LOGOBACKDROP
  pour Top (isolate 0.61, rank 2): 84.45,96.52 100.33,96.52 100.33,76.2 84.45,76.2
  pour Top (isolate 0.61, rank 2): 75.56,68.58 91.44,68.58 91.44,59.69 75.56,59.69
N$1
  Top 0.305: U1.2 27.3,48.9 27.94,49.53 27.94,53.07 C4.1
N$2
  Top 0.305: C5.2 21.86,49.9 22.23,49.53 U1.6
N$3
  Top 0.305: U1.14 26.04,42.55 24.13,44.45 17.78,44.45 15.24,41.91 15.24,31.75 7.62,24.13 7.62,17.78 8.24,17.16 X2_GROUNDSTATION.2
N$4
  Top 0.305: C2.2 26.67,50.53 26.67,49.53 26.04,48.9 U1.3
N$5
  Top 0.305: C2.1 28.57,50.44 U1.1
N$6
  Top 0.305: C3.1 24.77,50.44 U1.4
N$7
  Top 0.305: C3.2 23.5,50.44 U1.5
N$8
  Top 0.305: X2_GROUNDSTATION.3 16.51,23.97 16.51,40.64 19.05,43.18 24.13,43.18 24.77,42.55 U1.13
N$9
  Top 0.305: X3_DEBUG.2 17.46,53.66 20.95,50.16 U1.7
N$10
  Top 0.305: U1.8 19.68,50.16 17.78,52.07 12.06,52.07 10.79,53.34 10.79,53.98 11.43,54.61 11.43,55.39 X3_DEBUG.3
N$11
  Top 0.305: C10.1 87.77,31.62 Q1.1 81.5,29.3 arc-45 81.28,29.21 78.74,29.21 77.89,30.06 arc45 77.67,30.15 U2.37
N$12
  Top 0.305: C11.1 87.77,26.8 Q1.2 82.56,26.8 arc-45 82.33,26.89 81.28,27.94 78.87,27.94 arc-45 78.65,28.03 77.42,29.26 arc45 77.2,29.35 U2.36
N$13
  Top 0.305: U2.34 76.26,27.75 arc-45 76.48,27.66 84.45,19.68 94.48,19.68 arc45 94.71,19.78 SV6.1
N$14
  Top 0.305: U2.35 76.73,28.55 arc-45 76.95,28.46 82.14,23.27 arc45 82.37,23.18 R1.2 91.03,25.31 arc-45 91.26,25.4 95.25,25.4 SV6.5
N$15
  Top 0.305: R39.2 125.63,68.18 LED2_SOE.A 135.75,68.25 T3_SOE.A
N$16
  Top 0.254: Q2.3 54.61,96.52 52.07,99.06 26.67,99.06 26.04,99.69 26.04,102.89 U$6.PIN2
N$17
  Top 0.305: R40.2 arc-45 123.36,53.25 LED3_SODS.A 135.65,53.25 arc45 135.82,53.32 T10_SODS.A
N$18
  Top 0.406: U6.3 120.02,8.26 | 120.02,8.26 120.02,9.53 | 120.02,9.53 120.02,10.16 119.38,10.79 U6.5 | U6.4 120.02,9.53 | 120.02,8.26 C17.1
N$19
  Top 0.191: U6.6 117.88,12.06 arc90 118.02,12.21 arc-90 118.21,12.39 122.33,12.39 arc-78 R12.1
N$20
  Top 0.305: U$5.2 35.24,94.61 R9.1 36.05,93.81 Q3.3
N$21
  Top 0.305: Q4.3 46.84,94.93 R11.1 42.23,95.89 U$5.3
N$22
  Top 0.191: 117.87,13.39 arc-60 118.66,12.99 arc61 119.05,12.8 122.12,12.8 arc90 R13.1
  Top 0.305: 117.87,13.39 117.63,13.39 U6.7
N$23
  Top 0.305: LED8.A R49.1
N$24
  Top 0.191: U8.6 arc90 133.49,6.69 140.16,6.69 arc90 141.73,8.27 arc-90 143.61,10.34 144.04,10.34 arc-90 144.29,10.09 144.29,7.88 arc90 144.49,7.68 144.49,7.68 arc90 144.69,7.87 144.69,9.84 arc-90 145.08,10.24 146.06,10.24 arc-90 146.5,9.8 X1.2 | 132.09,8.24 arc52 131.89,8.66 arc39 130.71,8.88 arc-39 129.53,9.45 arc-14 128.35,10.63 arc90 127.55,11.43 R12.2
  Top 0.254: 132.09,8.24 U8.6
N$25
  Top 0.305: C21.1 67.94,47.35 67.94,48.26 68.9,49.22 U7.4
N$26
  Top 0.305: T8_LO.A1 141.37,81.14 T1_LO.3 T1_LO.4 127.17,80.01 R16.1
N$27
  Top 0.305: T3_SOE.A1 141.37,66.14 T2_SOE.3 T2_SOE.4 126.78,66.14 R17.1
N$28
  Top 0.305: T10_SODS.A1 141.37,51.13 T9_SODS.3 T9_SODS.4 126.38,51.13 R18.1
N$29
  Top 0.191: R14.2 101.65,15.48 arc-90 101.97,15.16 101.97,14.49 arc90 102.29,14.17 108.11,14.17 arc90 108.43,14.49 U6.9
N$30
  Top 0.191: R15.2 100.08,12 arc90 100.39,12.32 100.39,13.46 arc-90 100.71,13.78 107.99,13.78 arc-90 U6.10
N$31
  Top 0.305: R37.2 123.26,83.25 LED1_LO.A 135.75,83.25 T8_LO.A
N$32  (via drill 0.6)
  Top 0.305: SJ6.1 U$4.10 | SJ5.1 56.39,76.39 v56.2,76.2
  Bottom 0.305: v56.2,76.2 U$4.10
N$34
  Top 0.406: R36.2 82.55,112.49 Q13.1 86.38,109.22 D1.A
N$35
  Top 0.305: T6_PWR.A1 141.37,36.13 T4_PWR.3 T4_PWR.4 127.72,35.56 R19.1
N$37  (via drill 0.6)
  Top 0.305: T5_ERRINH.3 141.37,21.14 T7_ERRINH.A1 | R20.1 126.22,21.14 T5_ERRINH.4 132.76,21.14 arc45 132.99,21.23 v133.35,21.59
  Bottom 0.305: T7_ERRINH.A1 134.35,22.46 arc45 134.13,22.37 v133.35,21.59
N$38
  Top 0.305: Q5.3 37.56,17.86 arc-45 37.47,18.08 OK1.3
N$39
  Top 0.305: OK1.6 37.47,31.3 arc45 37.37,31.53 R23.1 30.93,33.97 arc-45 30.71,34.06 29.21,35.56 26.8,35.56 arc-45 26.58,35.65 22.32,39.91 arc-45 22.23,40.14 U1.11
N$40
  Top 0.305: Q5.1 44.3,16.2 Q6.3 44.45,14.29 R21.1
N$41
  Top 0.305: Q11.1 21.91,34.14 Q12.3 23.81,34.29 R31.1
N$42
  Top 0.305: R22.1 36.29,16.1 arc-45 36.2,16.33 OK1.2
N$43
  Top 0.305: OK2.3 Q7.3
N$44
  Top 0.305: OK2.2 28.57,20.64 R25.1
N$45
  Top 0.305: OK2.6 29.84,31.43 R26.1 26.99,33.97 20.95,40.01 U1.10
N$46
  Top 0.305: Q7.1 28.89,13.97 | 28.89,13.97 28.89,12.85 Q8.3 | R24.1 26.91,14.04 arc45 27.09,13.97 28.89,13.97
N$47
  Top 0.305: Q9.1 35.71,38.41 Q10.3 37.54,40.55 arc-45 37.77,40.64 R28.1
N$48
  Top 0.305: Q9.3 43.72,35.48 arc-45 43.81,35.26 OK3.3
N$49
  Top 0.305: OK4.3 Q11.3
N$50
  Top 0.305: R29.1 44.99,37.88 arc-45 45.09,37.65 OK3.2
N$51
  Top 0.305: OK4.2 22.23,25.72 R32.1
N$52
  Top 0.305: Q10.1 34.24,36.74 arc45 34.01,36.83 26.8,36.83 arc-45 26.58,36.92 23.59,39.91 arc-45 23.5,40.14 U1.12
N$53
  Top 0.305: U1.9 19.68,35.41 Q12.1
N$54
  Top 0.305: OK4.6 20.95,15.56 R30.1 21.27,13.91 arc45 21.37,13.68 22,13.05 arc45 22.23,12.95 23.62,12.95 27.69,8.89 62.23,8.89 65.29,11.95 R33.2
N$55
  Top 0.254: R34.2 67.32,14.29 R35.2
  Top 0.305: Q8.1 32.53,10.16 60.64,10.16 R34.2
N$56
  Top 0.406: X2_GROUNDSTATION.G1 11.69,6.86 SJ1.2
N$57
  Top 0.406: X3_DEBUG.G2 11.59,69.34 SJ2.1
N$58
  Top 0.406: X4.G1 11.55,80.77 SJ3.2
N$59  (via drill 0.6)
  Top 0.305: JP2.1 JP1.2 | R34.1 64.45,16.51 v62.23,16.51
  Bottom 0.305: v62.23,16.51 JP1.2
N$60
  Top 0.61: 83.82,101.6 Q13.3
  Top 0.813: 92.71,104.14 U$9.P$1 | 92.71,104.14 92.71,102.87 88.9,99.06 83.82,99.06 83.82,101.6 | Q13.3 81.75,99.57 SJ9.1 SJ8.1 SJ7.1 70.61,99.57 69.22,100.97 | X6.1 92.73,104.17 92.71,104.14
  pour Top: 71.44,100.33 71.44,104.14 70.17,105.41 57.47,105.41 57.47,101.28 58.42,100.33
N$61
  Top 0.305: R43.2 123.26,23.25 LED4_ERRINH.A 135.75,23.25 T7_ERRINH.A
N$63
  Top 0.305: R44.2 123.26,38.25 LED5_PWR.A 135.75,38.25 T6_PWR.A
N$65
  Top 0.305: R46.1 138.3,95.25 arc45 138.52,95.34 144.36,101.18 arc45 144.45,101.4 LED6.A
N$66
  Top 0.305: R47.1 138.3,99.06 arc45 138.52,99.15 142.24,102.87 142.24,105.2 arc-45 142.33,105.42 LED7.A
N$67
  Top 0.305: U5.6 40.64,72.01 40.64,80.01 41.91,81.28 U$4.13
N$68
  Top 0.191: X1.3 148.5,10.25 arc90 147.96,10.79 143.47,10.79 arc90 141.34,8.66 141.34,8.27 arc-90 140.16,7.09 133.46,7.09 arc-90 132.68,7.87 arc36 U8.1 arc-30 131.89,10.24 arc68 129.92,12.6 126.77,12.6 arc-90 125.98,13.39 125.98,13.4 arc90 R13.2
N$70
  Top 0.813: U$10.P22 U$10.P23 58.42,58.42 64.77,64.77 64.77,67.04 C31.1 64.58,67.39 arc45 64.67,67.61 L1.P1
RESERVED_ADC_0
  Top 0.305: U2.44 79.27,39.37 95.25,39.37 SV4.4
RESERVED_ADC_1
  Top 0.305: SV4.3 76.94,40.64 U2.1
RESERVED_IO_0
  Top 0.305: U2.24 66.65,24.74 59.69,17.78 54.61,17.78 53.34,16.51 53.34,13.97 SV5.3
RESERVED_IO_1
  Top 0.305: SV5.4 55.88,16.51 59.69,16.51 67.45,24.27 U2.25
RESERVED_UART0_RX
  Top 0.254: SV2.4 53.34,35.56 55.88,35.56 56.52,34.92 59.69,34.92 62.06,32.55 U2.16
RESERVED_UART0_TX
  Top 0.254: SV2.3 59.69,34.29 62.23,31.75 U2.17
RESERVED_UART1_RX
  Top 0.305: U2.32 73.05,24.87 arc45 73.14,24.65 73.66,24.13 74.93,24.13 81.19,17.87 arc-45 81.28,17.65 SV3.4
RESERVED_UART1_TX
  Top 0.305: U2.33 74.25,25.95 arc-45 74.47,25.86 82.55,17.78 82.55,13.97 SV3.3
SW_ERRINH
  Top 0.305: R20.2 123.51,17.83 C29.1 92.84,17.78 arc45 92.62,17.69 84.45,9.53 75.56,9.53 74.3,10.79 74.3,15.88 69.94,20.23 arc-45 69.85,20.45 U2.28
SW_LO  (via drill 0.6)
  Top 0.305: R16.2 123.46,79.96 C25.1 118.75,77.47 v109.86,68.58 | U2.7 69.05,38.57 v69.85,39.37 | v74.93,45.72 85.09,45.72 v104.14,64.77
  Bottom 0.305: v69.85,39.37 69.85,40.64 v74.93,45.72 | v104.14,64.77 105.94,64.77 arc45 106.12,64.84 v109.86,68.58
SW_PWR
  Top 0.305: U2.29 70.65,20.92 arc45 70.74,20.7 74.93,16.51 74.93,11.56 arc45 75.02,11.34 76.2,10.16 83.69,10.16 arc45 83.91,10.25 92.08,18.41 108.86,18.41 C28.1 | 123.1,32.93 arc-45 123.32,33.02 C28.1 | C28.1 arc45 123.51,33.14 R19.2
SW_SODS  (via drill 0.6)
  Top 0.305: v115.57,44.45 121.92,44.45 123.46,45.99 C27.1 123.51,47.67 R18.2 | v71.12,40.01 70.65,39.53 U2.5 | v75.56,44.45 v97.79,44.45
  Bottom 0.305: v75.56,44.45 v71.12,40.01 | v97.79,44.45 v115.57,44.45
SW_SOE  (via drill 0.6)
  Top 0.305: R17.2 123.46,64.72 C26.1 v109.22,62.23 | v99.06,62.23 83.82,46.99 v80.01,46.99 | v72.39,33.02 71.12,33.02 69.85,34.29 U2.6
  Bottom 0.305: v109.22,62.23 v99.06,62.23 | v80.01,46.99 72.39,39.37 v72.39,33.02
UART_EXP_RX  (via drill 0.6)
  Top 0.254: U2.12 64.05,36.28 v55.88,44.45
  Top 0.305: Q3.2 40.49,91.44 40.64,91.44 40.32,91.12 R8.1 40.32,86.68 40.64,86.36 41.91,86.36 43.18,85.09 43.18,71.12 49.53,64.77 v49.53,50.8 | U2.12 65.72,35.75 arc-45 65.94,35.66 68.58,33.02 68.58,30.48 60.96,22.86 JP1.1
  Bottom 0.305: v55.88,44.45 v49.53,50.8
UART_EXP_TX  (via drill 0.6)
  Top 0.254: U2.13 63.22,34.95 54.99,43.18 v54.61,43.18
  Top 0.305: Q4.2 R10.1 47.94,87.95 48.26,87.63 48.26,67.31 50.8,64.77 v50.8,46.99 | U2.13 65.38,34.95 67.31,33.02 v67.31,30.48
  Bottom 0.305: v54.61,43.18 v50.8,46.99 | JP2.2 55.88,24.13 62.23,24.13 67.31,29.21 v67.31,30.48
UART_GND_RX
  Top 0.305: OK3.6 43.81,23.5 44.45,22.86 47.95,22.86 R27.1 49.22,23.18 49.53,22.86 52.07,22.86 54.61,25.4 60.96,25.4 63.31,27.75 U2.22
UART_GND_TX
  Top 0.305: Q6.1 47.48,20.32 50.8,20.32 52.07,21.59 62.23,21.59 65.85,25.21 U2.23
USB_GND  (via drill 0.6)
  Top 0.305: C18.2 v127,5.08
  Top 0.406: C18.2 124.19,6.99 | 124.19,6.99 C17.2 124.19,8.62 124.46,8.89 | U6.2 124.19,6.99 | R48.2 144.46,16.46 C34.1 146.05,16.51 148.5,14.06 X1.4 149.04,12.25 149.86,11.43 149.86,7.62 148.08,5.84 SJ4.1
  other vias: 129.54,15.24 154.94,13.97 147.32,6.35 142.24,11.43
  pour Bottom: 157.48,2.54 115.57,2.54 115.57,15.88 128.27,15.88 130.81,18.41 157.48,18.41
  pour Top (isolate 0.508): 115.57,15.88 115.57,2.54 157.48,2.54 157.48,18.41 130.81,18.41 128.27,15.88
USB_SHIELD  (via drill 0.6)
  Top 0.305: U8.2 arc90 130.34,10.79 v130.18,10.79 | SJ4.2 134.75,4.32 v134.62,4.45
  Top 0.406: R48.1 142.56,16.46 C34.2 142.51,17.41 143.51,18.41 147.96,18.41 149.35,17.02 X1.S2 155.7,17.02 157.48,15.24 157.48,6.35 156.21,5.08 151.31,5.08 X1.S1 150.54,4.32 SJ4.2
  Bottom 0.305: v134.62,4.45 130.18,8.89 v130.18,10.79
USB_VBUS  (via drill 0.6)
  Top 0.305: U8.5 131.44,7.62 arc-90 130.81,6.99 v130.18,6.99
  Top 0.406: U6.1 121.56,5.71 C18.1 122.19,4.17 123.83,2.54 131.44,2.54 v132.72,3.81
  Bottom 0.406: X1.1 146.5,13.15 147.32,13.97 151.13,13.97 153.67,11.43 153.67,3.81 152.4,2.54 133.99,2.54 v132.72,3.81 130.18,6.35 v130.18,6.99
VDD  (via drill 0.6)
  Top 0.305: R32.2 R31.2 R26.2 | R26.2 OK2.8 | R26.2 28.57,30.8 OK2.7 28.57,27.44 arc45 28.67,27.21 29.21,26.67 34.29,26.67 34.83,27.21 arc45 34.92,27.44 OK1.8 arc45 34.93,28.48 R23.2 | OK1.7 36.2,30.67 arc45 36.1,30.9 R23.2 | U1.16 28.95,41 arc45 29.17,40.91 C1.1 33.02,40.91 | R29.2 40.77,40.32 arc-45 40.55,40.41 R28.2 40.32,40.83 arc45 40.23,41.05 39.37,41.91 36.83,41.91 35.92,41 arc-45 35.7,40.91 33.02,40.91 | R23.2 34.7,31.84 arc-45 34.48,31.75 v33.02,31.75 | v33.02,39.37 33.02,40.91
  Top 0.406: 36.83,44.09 36.83,41.91
  Top 0.813: U$10.P14 35.56,45.62 arc45 35.65,45.4 36.74,44.31 36.78,44.36 arc-45 37.01,44.45 C32.1 36.9,44.24 arc45 36.83,44.09
  Bottom 0.305: v33.02,31.75 v33.02,39.37
VI
  Top 0.813: U3.1 63.5,93.98 62.29,95.19 L2.P1 61.06,97.62 C35.1
VSS  (via drill 0.6)
  Top 0.305: Q9.2 39.39,36.37 38.73,36.37 | 38.73,36.37 Q10.2 35.5,37.37 arc45 35.28,37.47 29.98,37.47 arc-45 29.75,37.56 27.4,39.91 arc-45 27.3,40.14 U1.15 27.3,42.41 arc-45 27.4,42.64 27.94,43.18 30.08,43.18 arc-45 30.3,43.09 | Q12.2 19.86,30.46 | 19.86,30.46 Q11.2 | C5.1 C4.2 24.49,54.52 arc45 24.27,54.61 16.64,54.61 arc-45 16.42,54.7 15.24,55.88 15.24,58.95 arc45 15.15,59.18 X3_DEBUG.5 16.42,65.86 arc45 16.51,66.09 SJ2.2 | C1.2 30.3,43.09 | 19.86,30.46 19.86,28.88 arc-45 19.76,28.65 v19.05,27.94 | OK2.5 v31.11,30.61 | OK1.5 v38.73,30.61 38.73,36.37 | 30.3,43.09 30.39,43.09 30.48,43.18 | 16.51,8.89 13.97,11.43 v12.7,11.43
  Top 0.406: C4.2 25.67,53.48 arc-45 25.76,53.7 26.67,54.61 30.48,54.61 | 30.48,54.61 34.16,54.61 arc-45 34.38,54.52 | 30.48,43.18 30.48,54.61
  Top 0.813: 40.55,45.4 arc45 40.64,45.62 | C32.2 39.56,44.45 arc45 39.78,44.54 40.64,45.4
  Bottom 0.305: v19.05,27.94 21.72,30.61 v31.11,30.61
  Bottom 0.406: v31.11,30.61 v38.73,30.61 | v19.05,27.94 15.12,27.94 arc45 14.9,27.85 X2_GROUNDSTATION.5
  other vias: 6.35,38.1 27.94,60.96
  pour Bottom (isolate 0.508): 1.27,2.54 17.78,2.54 17.78,22.86 25.4,22.86 25.4,26.67 40.64,26.67 40.64,30.48 46.99,30.48 46.99,38.1 43.18,41.91 43.18,48.26 20.32,71.12 1.27,71.12 1.27,49.53 3.81,49.53 3.81,67.31 10.16,67.31 10.16,57.78 12.7,57.78 12.7,53.34 15.24,53.34 15.24,48.26 1.27,48.26
  pour Top (isolate 0.508): 1.27,2.54 17.78,2.54 17.78,22.86 25.4,22.86 25.4,26.67 40.64,26.67 40.64,30.48 46.99,30.48 46.99,38.1 43.18,41.91 43.18,48.26 20.32,71.12 10.16,71.12 10.16,62.87 15.24,62.87 15.24,55.88 1.27,55.88

## Text on the board
Top: V- V+ | DL / ->GND | UL / EXP<- | Bit / Error / Rate | LO | EXP | SOE | DEBUG / Charging Line | SODS | R/ADC | Rate | Dropout | Duration | PWR | R/UART0 | ERROR / INHIBIT | PDI | R/UART1 | Groundstation | USB | R/IO
Bottom: 2015-June-18 / Nicolas Benes, benes@in.tum.de, OpenPGP: 9CF7E24E92CAE7898C3B / Max Rößner, m.roessner@tum.de
tStop: V- V+ | DL / ->GND | UL / EXP<- | Bit / Error / Rate | LO | EXP | SOE | DEBUG / Charging Line | SODS | Rate | Dropout | Duration | PWR | ERROR / INHIBIT | Groundstation